# Altium schematic sheet EN-C200_RA0_USB.SchDoc
size A4
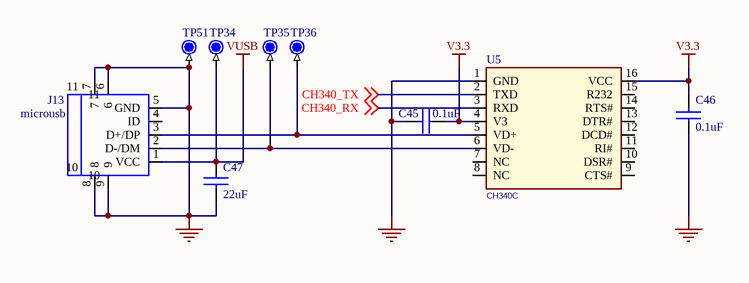
[diagram p0: EN-C200_RA0_USB.SchDoc]

## Parts
C45  0.1uF  [SC0603]
C46  0.1uF  [SC0603]
C47  22uF  [SC0805]
J13  microusb  [MICROUSB_D]
TP34  NC  [TP32-SMD]  (value not drawn)
TP35  NC  [TP32-SMD]  (value not drawn)
TP36  NC  [TP32-SMD]  (value not drawn)
TP51  NC  [TP32-SMD]  (value not drawn)
U5  CH340C  [SOP16-50-150A]

## Nets
GND: C45.2 C46.1 C47.2 J13.5(GND) J13.6 J13.7 J13.8 J13.9 TP51.1 U5.1(GND)
V3.3: C45.1 C46.2 U5.4(V3) U5.16(VCC)
VUSB: C47.1 J13.1(VCC) TP34.1
CH340_RX: U5.3(RXD) ; off-sheet CH340_RX
CH340_TX: U5.2(TXD) ; off-sheet CH340_TX
NetJ13_2: J13.2(D-/DM) TP35.1 U5.6(VD-)
NetJ13_3: J13.3(D+/DP) TP36.1 U5.5(VD+)

Not connected (* = marked no-connect by the designer): J13 4(ID) 10 11; U5 7(NC) 8(NC) 9(CTS#) 10(DSR#) 11(RI#) 12(DCD#) 13(DTR#) 14(RTS#) 15(R232)

## Library data of the parts
C45-C47 = CAP NP
TP34-TP36 TP51 = TP
U5 = CH340C_0